# EAGLE design leds-smd (EAGLE 8.0.2)
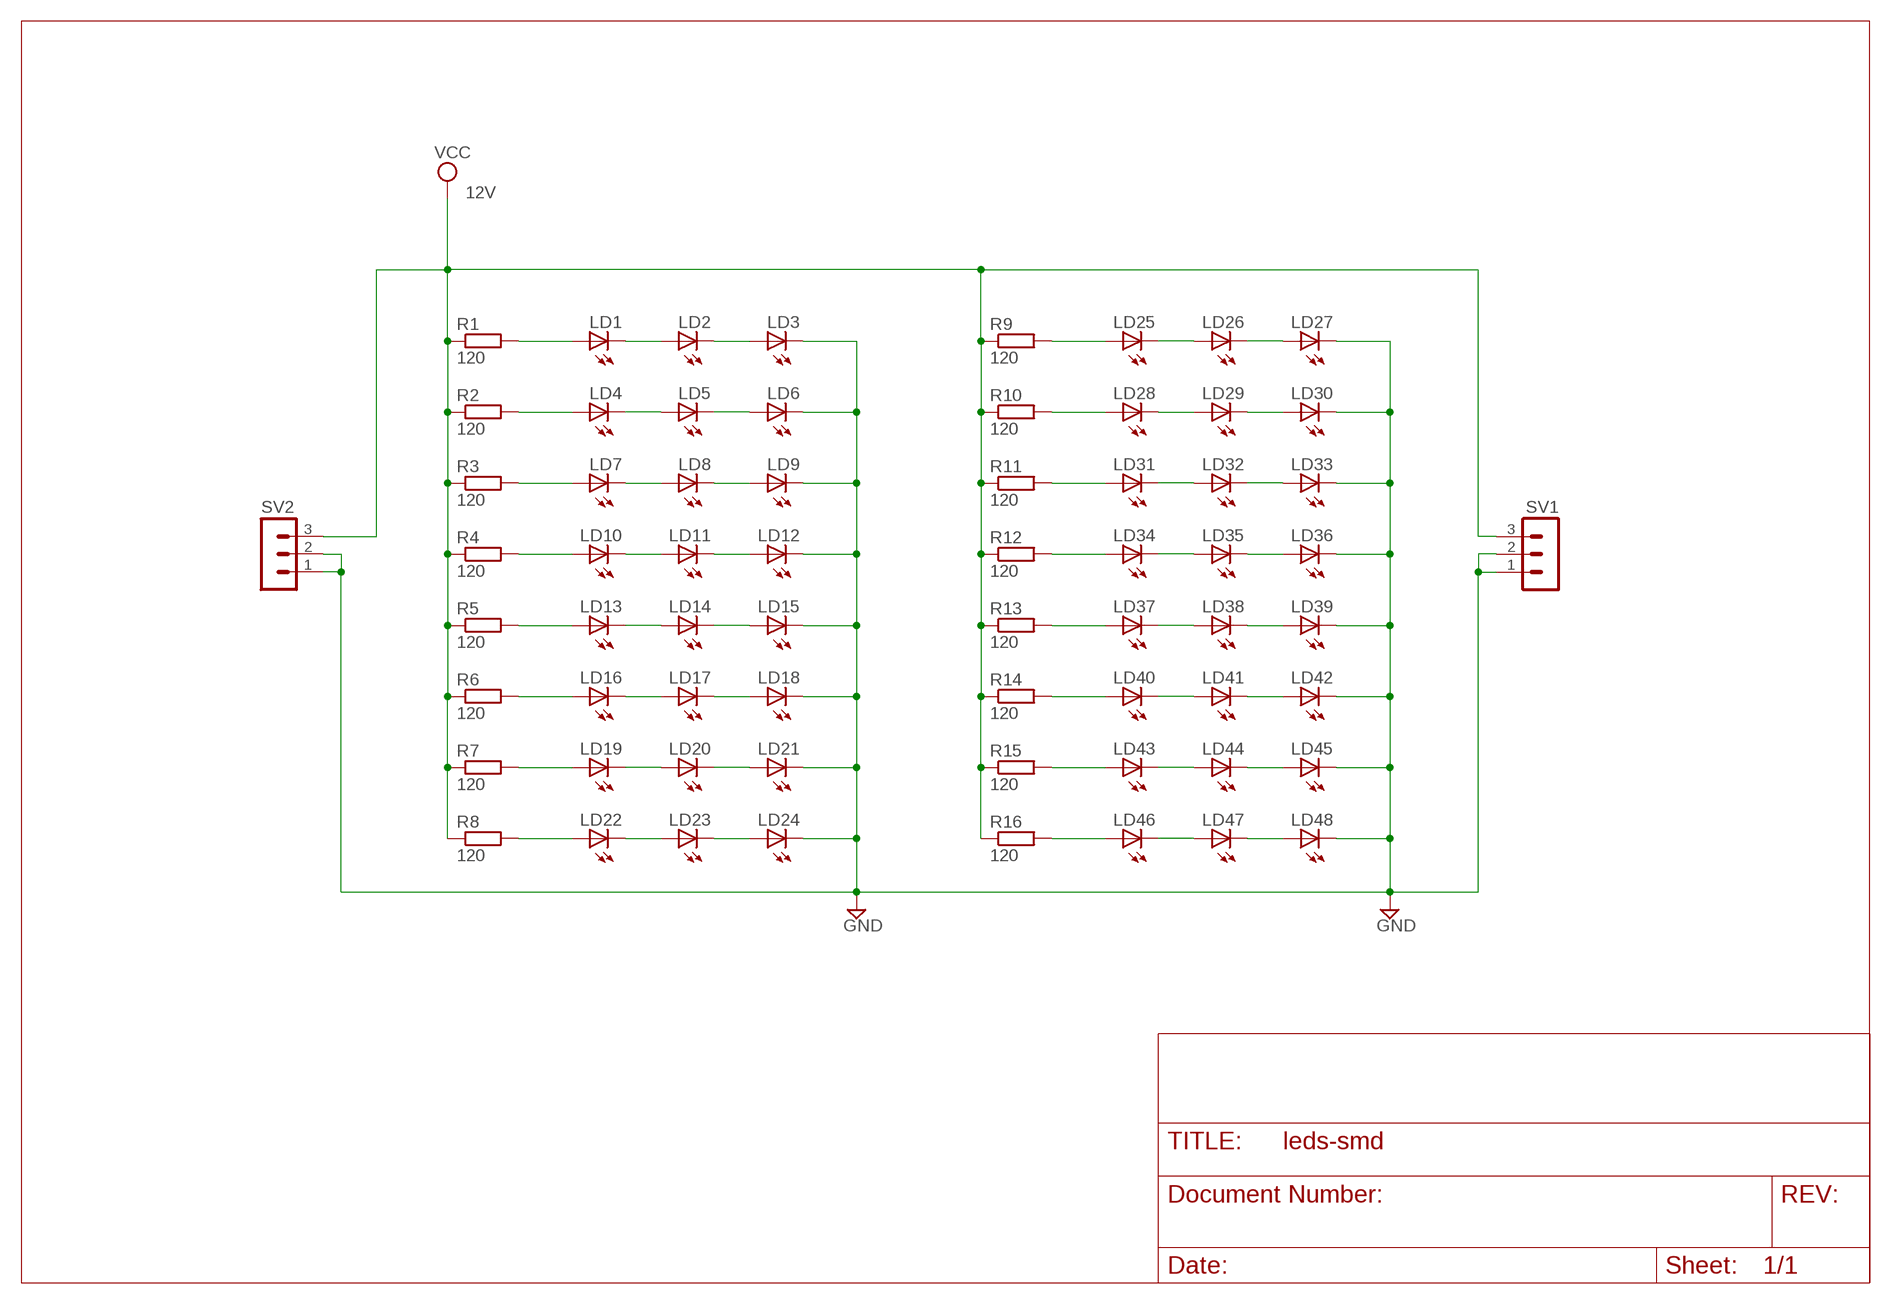
[diagram p0: schematic, sheet 1]

## Parts
LD1  LED5MM  [LED5MM]
LD2  LED5MM  [LED5MM]
LD3  LED5MM  [LED5MM]
LD4  LED5MM  [LED5MM]
LD5  LED5MM  [LED5MM]
LD6  LED5MM  [LED5MM]
LD7  LED5MM  [LED5MM]
LD8  LED5MM  [LED5MM]
LD9  LED5MM  [LED5MM]
LD10  LED5MM  [LED5MM]
LD11  LED5MM  [LED5MM]
LD12  LED5MM  [LED5MM]
LD13  LED5MM  [LED5MM]
LD14  LED5MM  [LED5MM]
LD15  LED5MM  [LED5MM]
LD16  LED5MM  [LED5MM]
LD17  LED5MM  [LED5MM]
LD18  LED5MM  [LED5MM]
LD19  LED5MM  [LED5MM]
LD20  LED5MM  [LED5MM]
LD21  LED5MM  [LED5MM]
LD22  LED5MM  [LED5MM]
LD23  LED5MM  [LED5MM]
LD24  LED5MM  [LED5MM]
LD25  LED5MM  [LED5MM]
LD26  LED5MM  [LED5MM]
LD27  LED5MM  [LED5MM]
LD28  LED5MM  [LED5MM]
LD29  LED5MM  [LED5MM]
LD30  LED5MM  [LED5MM]
LD31  LED5MM  [LED5MM]
LD32  LED5MM  [LED5MM]
LD33  LED5MM  [LED5MM]
LD34  LED5MM  [LED5MM]
LD35  LED5MM  [LED5MM]
LD36  LED5MM  [LED5MM]
LD37  LED5MM  [LED5MM]
LD38  LED5MM  [LED5MM]
LD39  LED5MM  [LED5MM]
LD40  LED5MM  [LED5MM]
LD41  LED5MM  [LED5MM]
LD42  LED5MM  [LED5MM]
LD43  LED5MM  [LED5MM]
LD44  LED5MM  [LED5MM]
LD45  LED5MM  [LED5MM]
LD46  LED5MM  [LED5MM]
LD47  LED5MM  [LED5MM]
LD48  LED5MM  [LED5MM]
R1  120  R-EU_M1206  [M1206]
R2  120  R-EU_M1206  [M1206]
R3  120  R-EU_M1206  [M1206]
R4  120  R-EU_M1206  [M1206]
R5  120  R-EU_M1206  [M1206]
R6  120  R-EU_M1206  [M1206]
R7  120  R-EU_M1206  [M1206]
R8  120  R-EU_M1206  [M1206]
R9  120  R-EU_M1206  [M1206]
R10  120  R-EU_M1206  [M1206]
R11  120  R-EU_M1206  [M1206]
R12  120  R-EU_M1206  [M1206]
R13  120  R-EU_M1206  [M1206]
R14  120  R-EU_M1206  [M1206]
R15  120  R-EU_M1206  [M1206]
R16  120  R-EU_M1206  [M1206]
SV1  MA03-1  [MA03-1]
SV2  MA03-1  [MA03-1]

## Nets
GND: LD3.K(C) LD6.K(C) LD9.K(C) LD12.K(C) LD15.K(C) LD18.K(C) LD21.K(C) LD24.K(C) LD27.K(C) LD30.K(C) LD33.K(C) LD36.K(C) LD39.K(C) LD42.K(C) LD45.K(C) LD48.K(C) SV1.1 SV1.2 SV2.1 SV2.2
N$2: LD43.A R15.2
N$3: LD1.A R1.2
N$4: LD4.A R2.2
N$5: LD7.A R3.2
N$6: LD10.A R4.2
N$7: LD13.A R5.2
N$8: LD16.A R6.2
N$9: LD19.A R7.2
N$10: LD43.K(C) LD44.A
N$11: LD1.K(C) LD2.A
N$12: LD2.K(C) LD3.A
N$13: LD5.K(C) LD6.A
N$14: LD4.K(C) LD5.A
N$15: LD7.K(C) LD8.A
N$16: LD8.K(C) LD9.A
N$17: LD44.K(C) LD45.A
N$18: LD10.K(C) LD11.A
N$19: LD11.K(C) LD12.A
N$20: LD14.K(C) LD15.A
N$21: LD13.K(C) LD14.A
N$22: LD16.K(C) LD17.A
N$23: LD17.K(C) LD18.A
N$24: LD20.K(C) LD21.A
N$25: LD19.K(C) LD20.A
N$26: LD46.A R16.2
N$27: LD46.K(C) LD47.A
N$28: LD22.A R8.2
N$29: LD25.A R9.2
N$30: LD28.A R10.2
N$31: LD31.A R11.2
N$32: LD34.A R12.2
N$33: LD37.A R13.2
N$34: LD40.A R14.2
N$35: LD22.K(C) LD23.A
N$36: LD23.K(C) LD24.A
N$37: LD26.K(C) LD27.A
N$38: LD25.K(C) LD26.A
N$39: LD28.K(C) LD29.A
N$40: LD29.K(C) LD30.A
N$41: LD32.K(C) LD33.A
N$42: LD31.K(C) LD32.A
N$43: LD34.K(C) LD35.A
N$44: LD37.K(C) LD38.A
N$45: LD40.K(C) LD41.A
N$46: LD35.K(C) LD36.A
N$47: LD38.K(C) LD39.A
N$48: LD41.K(C) LD42.A
N$49: LD47.K(C) LD48.A
VCC: R1.1 R2.1 R3.1 R4.1 R5.1 R6.1 R7.1 R8.1 R9.1 R10.1 R11.1 R12.1 R13.1 R14.1 R15.1 R16.1 SV1.3 SV2.3

## Notes on the sheet
- 12V

## Library data of the parts
LD1-LD48 = adafruit:LED: LED OSRAM: - CHIPLED LG R971, LG N971, LY N971, LG Q971, LY Q971, LO R971, LY R971 LH N974, LH R974 LS Q976, LO Q976, LY Q976 LO Q996 - Hyper CHIPLED LW Q18S LB Q993, LB Q99A, LB R99A - SideLED LS A670, LO A670, LY A670, LG A670, LP A670 LB A673, LV A673, LT A673, LW A673 LH A674 LY A675 LS A676, LA A676, LO A676, LY A676, LW A676 LS A679, LY A679, LG A679 - Hyper Micro SIDELED® LS Y876, LA Y876, LO Y876, LY Y876 LT Y87S - SmartLED LW L88C, LW L88S LB L89C, LB L89S, LG L890 LS L89K, LO L89K, LY L89K LS L896, LA L896, LO L896, LY L896 - TOPLED LS T670, LO T670, LY T670, LG T670, LP T670 LSG T670, LSP T670, LSY T670, LOP T670, LYG T670 LG T671, LOG T671, LSG T671 LB T673, LV T673, LT T673, LW T673 LH T674 LS T676, LA T676, LO T676, LY T676, LB T676, LH T676, LSB T676, LW T676 LB T67C, LV T67C, LT T67C, LS T67K, LO T67K, LY T67K, LW E67C LS E67B, LA E67B, LO E67B, LY E67B, LB E67C, LV E67C, LT E67C LW T67C LS T679, LY T679, LG T679 LS T770, LO T770, LY T770, LG T770, LP T770 LB T773, LV T773, LT T773, LW T773 LH T774 LS E675, LA E675, LY E675, LS T675 LS T776, LA T776, LO T776, LY T776, LB T776 LHGB T686 LT T68C, LB T68C - Hyper Mini TOPLED® LB M676 - Mini TOPLED Santana® LG M470 LS M47K, LO M47K, LY M47K Source: http://www.osram.convergy.de/
R1-R16 = resistor:R-EU_: RESISTOR, European symbol
SV1 SV2 = con-lstb:MA03-1: PIN HEADER; OC_FARNELL: unknown; OC_NEWARK: unknown

## Net classes
0 default: width 0.813 mm, drill 0.914 mm, clearance 0.813 mm

## Board
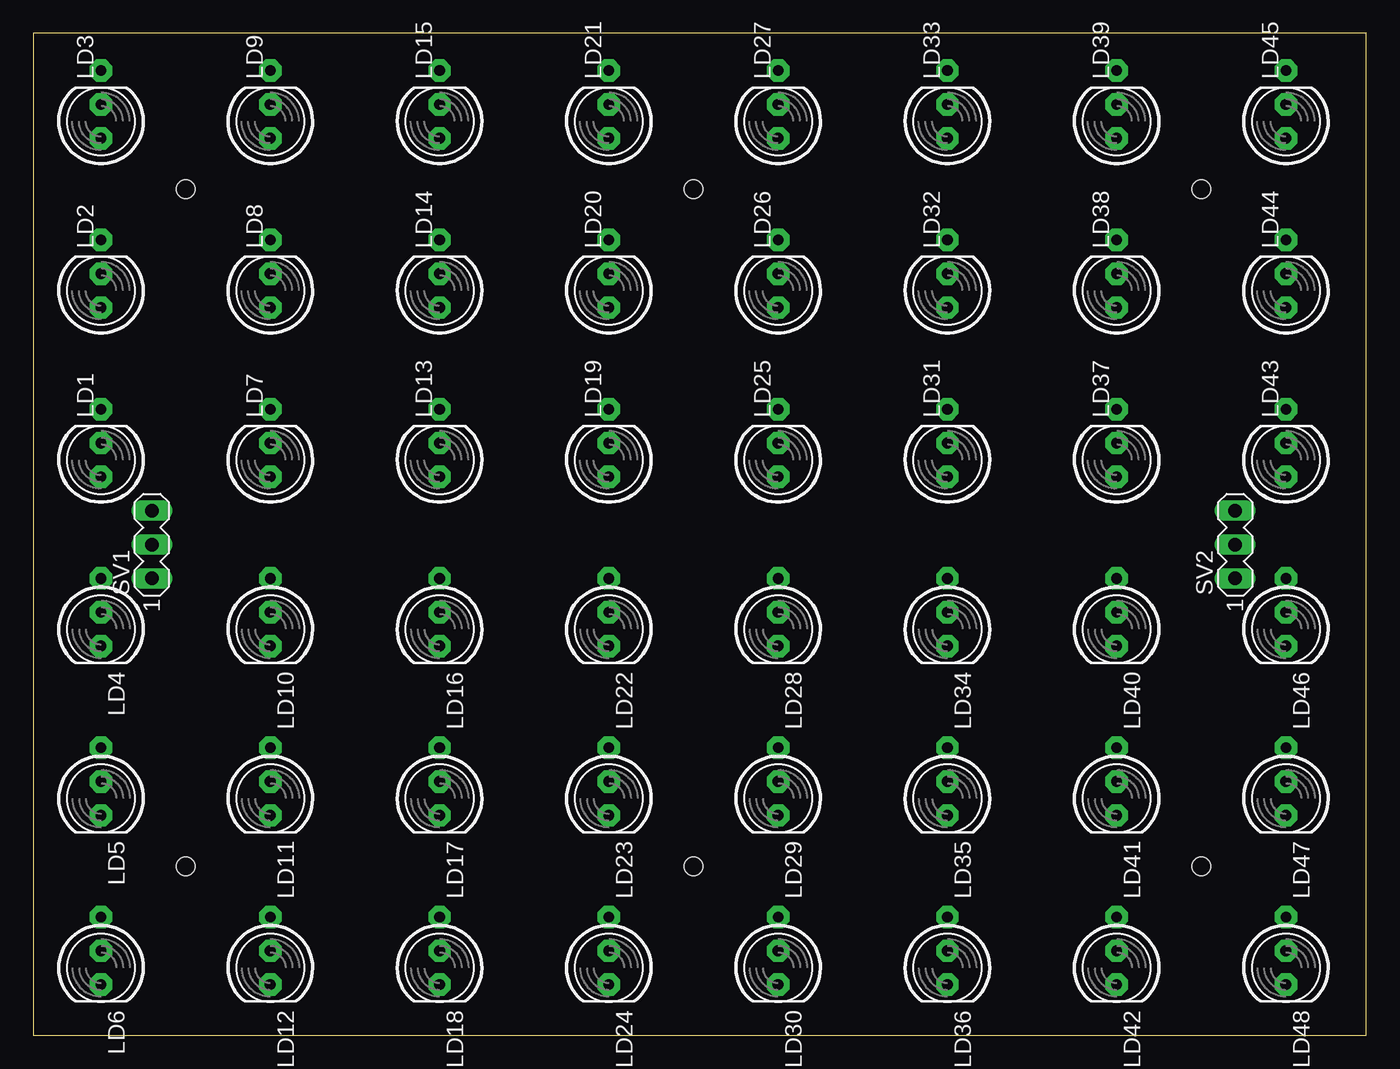
[diagram p1: board, top side]
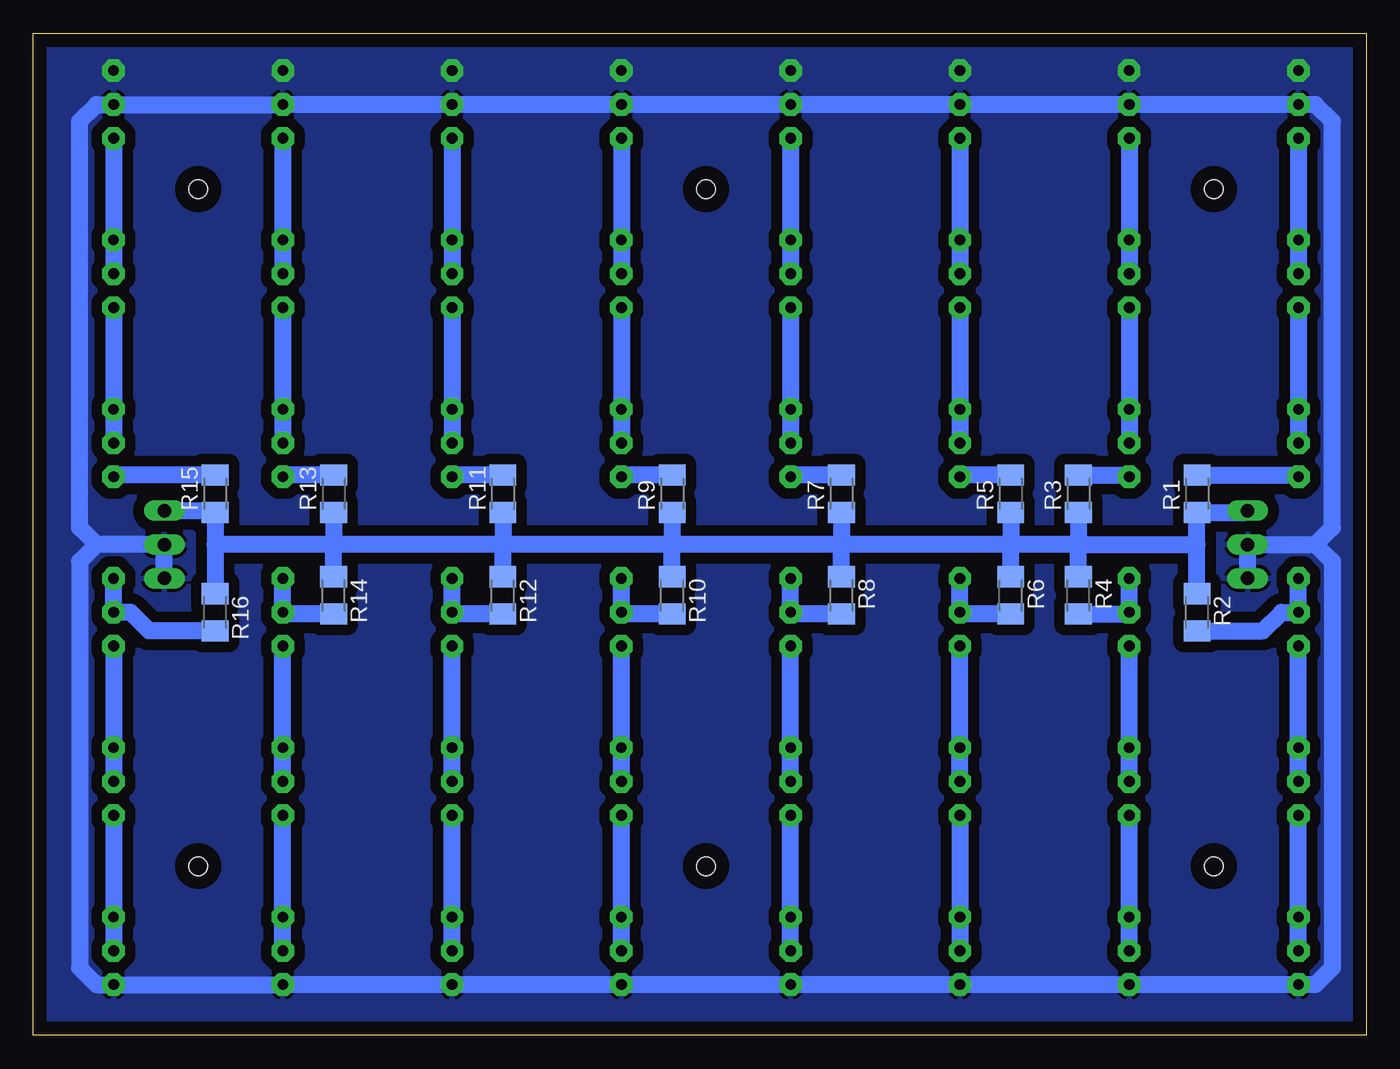
[diagram p2: board, bottom side, seen from below]

Size 100 x 75.19 mm. Coordinates in mm from the lower left corner, seen from the top.
Outline: 0,0 100,0 100,75.19 0,75.19 0,0
Copper layers (1*16): Top 0.035mm / dielectric 1.5mm / Bottom 0.035mm
Design rules "default": minimum track width 10mil, minimum drill 24mil, track to track 8mil, track to pad 8mil, pad to pad 8mil, via to via 8mil, smd to smd 8mil, copper to edge 40mil, drill to drill 8mil, minimum pad ring 10mil, minimum via ring 8mil, stop-mask expansion 4mil, vias tented up to drill 0mil, thermal gap 10mil
Holes 1.4 mm at 11.43,63.5 87.63,12.7 11.43,12.7 49.53,63.5 87.63,63.5 49.53,12.7

### Footprints (pad centres in the part's own frame; a part is rotated, then mirrored left to right if it is on the bottom)
LED5MM = drill 0.813 pad 1.676 octagon: A -1.27,0; K 1.27,0
M1206 = smd 1.6 x 2: 1 -1.4,0; 2 1.4,0
MA03-1 = drill 1.016 long: 1 -2.54,0; 2 0,0; 3 2.54,0

### Placement (x,y rotation side)
LD1  5.08,43.18 90 top
LD2  5.08,55.88 90 top
LD3  5.08,68.58 90 top
LD4  5.08,30.48 270 top
LD5  5.08,17.78 270 top
LD6  5.08,5.08 270 top
LD7  17.78,43.18 90 top
LD8  17.78,55.88 90 top
LD9  17.78,68.58 90 top
LD10  17.78,30.48 270 top
LD11  17.78,17.78 270 top
LD12  17.78,5.08 270 top
LD13  30.48,43.18 90 top
LD14  30.48,55.88 90 top
LD15  30.48,68.58 90 top
LD16  30.48,30.48 270 top
LD17  30.48,17.78 270 top
LD18  30.48,5.08 270 top
LD19  43.18,43.18 90 top
LD20  43.18,55.88 90 top
LD21  43.18,68.58 90 top
LD22  43.18,30.48 270 top
LD23  43.18,17.78 270 top
LD24  43.18,5.08 270 top
LD25  55.88,43.18 90 top
LD26  55.88,55.88 90 top
LD27  55.88,68.58 90 top
LD28  55.88,30.48 270 top
LD29  55.88,17.78 270 top
LD30  55.88,5.08 270 top
LD31  68.58,43.18 90 top
LD32  68.58,55.88 90 top
LD33  68.58,68.58 90 top
LD34  68.58,30.48 270 top
LD35  68.58,17.78 270 top
LD36  68.58,5.08 270 top
LD37  81.28,43.18 90 top
LD38  81.28,55.88 90 top
LD39  81.28,68.58 90 top
LD40  81.28,30.48 270 top
LD41  81.28,17.78 270 top
LD42  81.28,5.08 270 top
LD43  93.98,43.18 90 top
LD44  93.98,55.88 90 top
LD45  93.98,68.58 90 top
LD46  93.98,30.48 270 top
LD47  93.98,17.78 270 top
LD48  93.98,5.08 270 top
R1  12.7,40.64 90 bottom
R2  12.7,31.75 270 bottom
R3  21.59,40.64 90 bottom
R4  21.59,33.02 270 bottom
R5  26.67,40.64 90 bottom
R6  26.67,33.02 270 bottom
R7  39.37,40.64 90 bottom
R8  39.37,33.02 270 bottom
R9  52.07,40.64 90 bottom
R10  52.07,33.02 270 bottom
R11  64.77,40.64 90 bottom
R12  64.77,33.02 270 bottom
R13  77.47,40.64 90 bottom
R14  77.47,33.02 270 bottom
R15  86.36,40.64 90 bottom
R16  86.36,31.75 270 bottom
SV1  8.89,36.83 90 top
SV2  90.17,36.83 90 top

### Tracks (layer width: path | path; a pad name or v marks a point on that pad's centre or on a via)
GND  (via drill 0.8 pad 1.68)
  Bottom 1.27: SV2.1 SV2.2 95.25,36.83 | SV1.1 SV1.2 3.81,36.83 | 3.81,36.83 2.54,35.56 2.54,5.08 3.81,3.81 LD6.K LD12.K LD18.K LD24.K LD30.K LD36.K LD42.K LD48.K 95.25,3.81 96.52,5.08 96.52,35.56 95.25,36.83 | 3.81,36.83 2.54,38.1 2.54,68.58 3.81,69.85 LD3.K LD9.K LD15.K LD21.K LD27.K LD33.K LD39.K LD45.K 95.25,69.85 96.52,68.58 96.52,38.1 95.25,36.83
  other vias: 93.98,72.39 81.28,72.39 68.58,72.39 55.88,72.39 43.18,72.39 30.48,72.39 17.78,72.39 5.08,72.39
  pour Bottom: 0,74.93 100.33,74.93 100.33,0 0,0
N$2
  Bottom 1.27: R15.2 93.85,42.04 LD43.A
N$3
  Bottom 1.27: R1.2 5.21,42.04 LD1.A
N$4  (via drill 0.8 pad 1.68)
  Bottom 1.27: R2.2 7.75,30.35 6.35,31.75 LD4.A v5.08,34.29
N$5
  Bottom 1.27: R3.2 17.91,42.04 LD7.A
N$6  (via drill 0.8 pad 1.68)
  Bottom 1.27: R4.2 17.91,31.62 LD10.A v17.78,34.29
N$7
  Bottom 1.27: R5.2 30.35,42.04 LD13.A
N$8  (via drill 0.8 pad 1.68)
  Bottom 1.27: R6.2 30.35,31.62 LD16.A v30.48,34.29
N$9
  Bottom 1.27: R7.2 43.05,42.04 LD19.A
N$10  (via drill 0.8 pad 1.68)
  Bottom 1.27: LD44.A v93.98,46.99 LD43.K
N$11  (via drill 0.8 pad 1.68)
  Bottom 1.27: LD2.A v5.08,46.99 LD1.K
N$12  (via drill 0.8 pad 1.68)
  Bottom 1.27: LD3.A v5.08,59.69 LD2.K
N$13  (via drill 0.8 pad 1.68)
  Bottom 1.27: LD6.A v5.08,8.89 LD5.K
N$14  (via drill 0.8 pad 1.68)
  Bottom 1.27: LD5.A v5.08,21.59 LD4.K
N$15  (via drill 0.8 pad 1.68)
  Bottom 1.27: LD8.A v17.78,46.99 LD7.K
N$16  (via drill 0.8 pad 1.68)
  Bottom 1.27: LD9.A v17.78,59.69 LD8.K
N$17  (via drill 0.8 pad 1.68)
  Bottom 1.27: LD45.A v93.98,59.69 LD44.K
N$18  (via drill 0.8 pad 1.68)
  Bottom 1.27: LD11.A v17.78,21.59 LD10.K
N$19  (via drill 0.8 pad 1.68)
  Bottom 1.27: LD12.A v17.78,8.89 LD11.K
N$20  (via drill 0.8 pad 1.68)
  Bottom 1.27: LD15.A v30.48,59.69 LD14.K
N$21  (via drill 0.8 pad 1.68)
  Bottom 1.27: LD14.A v30.48,46.99 LD13.K
N$22  (via drill 0.8 pad 1.68)
  Bottom 1.27: LD17.A v30.48,21.59 LD16.K
N$23  (via drill 0.8 pad 1.68)
  Bottom 1.27: LD17.K v30.48,8.89 LD18.A
N$24  (via drill 0.8 pad 1.68)
  Bottom 1.27: LD21.A v43.18,59.69 LD20.K
N$25  (via drill 0.8 pad 1.68)
  Bottom 1.27: LD20.A v43.18,46.99 LD19.K
N$26  (via drill 0.8 pad 1.68)
  Bottom 1.27: R16.2 91.31,30.35 92.71,31.75 LD46.A v93.98,34.29
N$27  (via drill 0.8 pad 1.68)
  Bottom 1.27: LD46.K v93.98,21.59 LD47.A
N$28  (via drill 0.8 pad 1.68)
  Bottom 1.27: R8.2 43.05,31.62 LD22.A v43.18,34.29
N$29
  Bottom 1.27: R9.2 55.75,42.04 LD25.A
N$30  (via drill 0.8 pad 1.68)
  Bottom 1.27: R10.2 55.75,31.62 LD28.A v55.88,34.29
N$31
  Bottom 1.27: R11.2 68.45,42.04 LD31.A
N$32  (via drill 0.8 pad 1.68)
  Bottom 1.27: R12.2 68.45,31.62 LD34.A v68.58,34.29
N$33
  Bottom 1.27: R13.2 81.15,42.04 LD37.A
N$34  (via drill 0.8 pad 1.68)
  Bottom 1.27: R14.2 81.15,31.62 LD40.A v81.28,34.29
N$35  (via drill 0.8 pad 1.68)
  Bottom 1.27: LD23.A v43.18,21.59 LD22.K
N$36  (via drill 0.8 pad 1.68)
  Bottom 1.27: LD24.A v43.18,8.89 LD23.K
N$37  (via drill 0.8 pad 1.68)
  Bottom 1.27: LD27.A v55.88,59.69 LD26.K
N$38  (via drill 0.8 pad 1.68)
  Bottom 1.27: LD26.A v55.88,46.99 LD25.K
N$39  (via drill 0.8 pad 1.68)
  Bottom 1.27: LD29.A v55.88,21.59 LD28.K
N$40  (via drill 0.8 pad 1.68)
  Bottom 1.27: LD30.A v55.88,8.89 LD29.K
N$41  (via drill 0.8 pad 1.68)
  Bottom 1.27: LD33.A v68.58,59.69 LD32.K
N$42  (via drill 0.8 pad 1.68)
  Bottom 1.27: LD32.A v68.58,46.99 LD31.K
N$43  (via drill 0.8 pad 1.68)
  Bottom 1.27: LD35.A v68.58,21.59 LD34.K
N$44  (via drill 0.8 pad 1.68)
  Bottom 1.27: LD38.A v81.28,46.99 LD37.K
N$45  (via drill 0.8 pad 1.68)
  Bottom 1.27: LD41.A v81.28,21.59 LD40.K
N$46  (via drill 0.8 pad 1.68)
  Bottom 1.27: LD36.A v68.58,8.89 LD35.K
N$47  (via drill 0.8 pad 1.68)
  Bottom 1.27: LD39.A v81.28,59.69 LD38.K
N$48  (via drill 0.8 pad 1.68)
  Bottom 1.27: LD42.A v81.28,8.89 LD41.K
N$49  (via drill 0.8 pad 1.68)
  Bottom 1.27: LD47.K v93.98,8.89 LD48.A
VCC
  Bottom 1.27: SV2.3 86.49,39.37 R15.1 86.36,36.83 | 86.36,36.83 R16.1 | 64.77,36.83 77.47,36.83 | 52.07,36.83 64.77,36.83 | 39.37,36.83 52.07,36.83 | 26.67,36.83 39.37,36.83 | 21.59,36.83 26.67,36.83 | 21.59,36.83 12.7,36.83 | 77.47,36.83 86.36,36.83 | 12.7,36.83 R1.1 9.02,39.24 SV1.3 | R2.1 12.7,36.83 | R13.1 77.47,36.83 | R14.1 77.47,36.83 | R12.1 64.77,36.83 | R11.1 64.77,36.83 | R9.1 52.07,36.83 | R10.1 52.07,36.83 | R7.1 39.37,36.83 | R8.1 39.37,36.83 | R5.1 26.67,36.83 | R6.1 26.67,36.83 | R4.1 21.59,36.83 | R3.1 21.59,36.83